# Altium schematic sheet Display.SchDoc: Kookwekker
size A4; Author: Fabian Eppens; DrawnBy: Fabian Eppes; Revision: 1.0; SheetNumber: 3; SheetTotal: 3
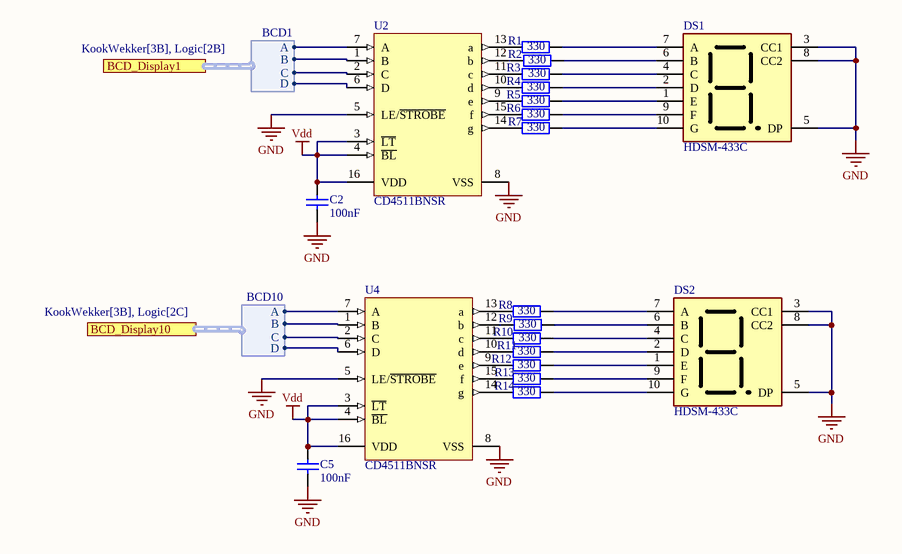
[diagram p0: Display.SchDoc]

## Parts
C2  100nF  [C1206]
C5  100nF  [C1206]
DS1  HDSM-433C  [HDSM433C]
DS2  HDSM-433C  [HDSM433C]
R1  330  [R1206]
R2  330  [R1206]
R3  330  [R1206]
R4  330  [R1206]
R5  330  [R1206]
R6  330  [R1206]
R7  330  [R1206]
R8  330  [R1206]
R9  330  [R1206]
R10  330  [R1206]
R11  330  [R1206]
R12  330  [R1206]
R13  330  [R1206]
R14  330  [R1206]
U2  CD4511BNSR  [TI-NS16_N]
U4  CD4511BNSR  [TI-NS16_N]

## Ports
BCD_Display1 (harness BCD1, see KookWekker[3B], Logic[2B]), BCD_Display10 (harness BCD10, see KookWekker[3B], Logic[2C])

## Harnesses
BCD1: A, B, C, D
BCD10: A, B, C, D

## Nets
GND: C2.1 C5.1 DS1.3(CC1) DS1.5(DP) DS1.8(CC2) DS2.3(CC1) DS2.5(DP) DS2.8(CC2) U2.5(LE/~{STROBE}) U2.8(VSS) U4.5(LE/~{STROBE}) U4.8(VSS)
Vdd: C2.2 C5.2 U2.3(~{LT}) U2.4(~{BL}) U2.16(VDD) U4.3(~{LT}) U4.4(~{BL}) U4.16(VDD)
NetDS1_1: DS1.1(E) R5.2
NetDS1_2: DS1.2(D) R4.2
NetDS1_4: DS1.4(C) R3.2
NetDS1_6: DS1.6(B) R2.2
NetDS1_7: DS1.7(A) R1.2
NetDS1_9: DS1.9(F) R6.2
NetDS1_10: DS1.10(G) R7.2
NetDS2_1: DS2.1(E) R12.2
NetDS2_2: DS2.2(D) R11.2
NetDS2_4: DS2.4(C) R10.2
NetDS2_6: DS2.6(B) R9.2
NetDS2_7: DS2.7(A) R8.2
NetDS2_9: DS2.9(F) R13.2
NetDS2_10: DS2.10(G) R14.2
NetR1_1: R1.1 U2.13(a)
NetR2_1: R2.1 U2.12(b)
NetR3_1: R3.1 U2.11(c)
NetR4_1: R4.1 U2.10(d)
NetR5_1: R5.1 U2.9(e)
NetR6_1: R6.1 U2.15(f)
NetR7_1: R7.1 U2.14(g)
NetR8_1: R8.1 U4.13(a)
NetR9_1: R9.1 U4.12(b)
NetR10_1: R10.1 U4.11(c)
NetR11_1: R11.1 U4.10(d)
NetR12_1: R12.1 U4.9(e)
NetR13_1: R13.1 U4.15(f)
NetR14_1: R14.1 U4.14(g)
NetU2_1: U2.1(B) ; port BCD_Display1.B
NetU2_2: U2.2(C) ; port BCD_Display1.C
NetU2_6: U2.6(D) ; port BCD_Display1.D
NetU2_7: U2.7(A) ; port BCD_Display1.A
NetU4_1: U4.1(B) ; port BCD_Display10.B
NetU4_2: U4.2(C) ; port BCD_Display10.C
NetU4_6: U4.6(D) ; port BCD_Display10.D
NetU4_7: U4.7(A) ; port BCD_Display10.A

## Notes on the sheet
- Size:
- Date:
- Drawn by:
- Revision:
- Hogeschool Windesheim
- Campus 2-6
- Postbus 10090
- A4
- Sheet
- of
- 8000GB, Zwolle

## Library data of the parts
C2 C5 = Capacitor_1206: SMD Capacitor 1206; Published: 03-11-2016; LatestRevisionDate: 03-11-2016; LatestRevisionNote: Creation; PackageReference: C1206; Publisher: Windesheim; PackageDescription: Chip Capacitor, Body 3.2x1.6mm, Height 1.7mm, IPC Medium Density; Value: 100nF
DS1 DS2 = HDSM-433C: Display; Manufacturer_Name: Avago Technologies; Datasheet Link: https://docs.broadcom.com/docs/AV02-0708EN; Height: 4mm; Manufacturer_Part_Number: HDSM-433C; Mouser Part Number: 630-HDSM-433C; Mouser Price/Stock: https://www.mouser.com/Search/Refine.aspx?Keyword=630-HDSM-433C; RS Part Number: 1783057; RS Price/Stock: http://uk.rs-online.com/web/p/products/1783057
R1-R14 = Resistor_1206: SMD Resistor 1206; Published: 03-11-2016; LatestRevisionDate: 03-11-2016; LatestRevisionNote: Creation; PackageReference: R1206; Publisher: Windesheim; PackageDescription: Chip Resistor, Body 3.2x1.6mm, IPC Medium Density; Value: 330
U2 U4 = CD4511BNSR: CMOS BCD-to-7-Segment LED Latch / Decoder / Driver, 3 to 18 V, -55 to 125 degC, 16-pin SOP (NS16), Green (RoHS & no Sb/Br); Manufacturer: Texas Instruments; Vin(Max)(V): 18; Rating: Military; Vin(Min)(V): 3; SubFamily: Discrete Segment LED Driver; ComponentLink3URL: http://www.ti.com/litv/pdf/msop002a; ComponentLink1Description: Manufacturer URL; PackageReference: NS16; ComponentLink3Description: Package Specification; ComponentLink1URL: http://www.ti.com/; DatasheetVersion: SCHS072B; Mounting Technology: Surface Mount; PartNumber: CD4511BNSR; ComponentLink2Description: Datasheet; PackageVersion: 4040062/C; ComponentLink2URL: http://www.ti.com/general/docs/lit/getliterature.tsp?genericPartNumber=CD4511B&fileType=pdf; Eco-Plan: Green (RoHS & no Sb/Br); PackageDescription: 16-Pin Plastic Small Outline, Body 10.20 x 5.30 mm, Pitch 1.27 mm